# EAGLE design Wave Motion (EAGLE 5.11)

## Sheet 1 of 6
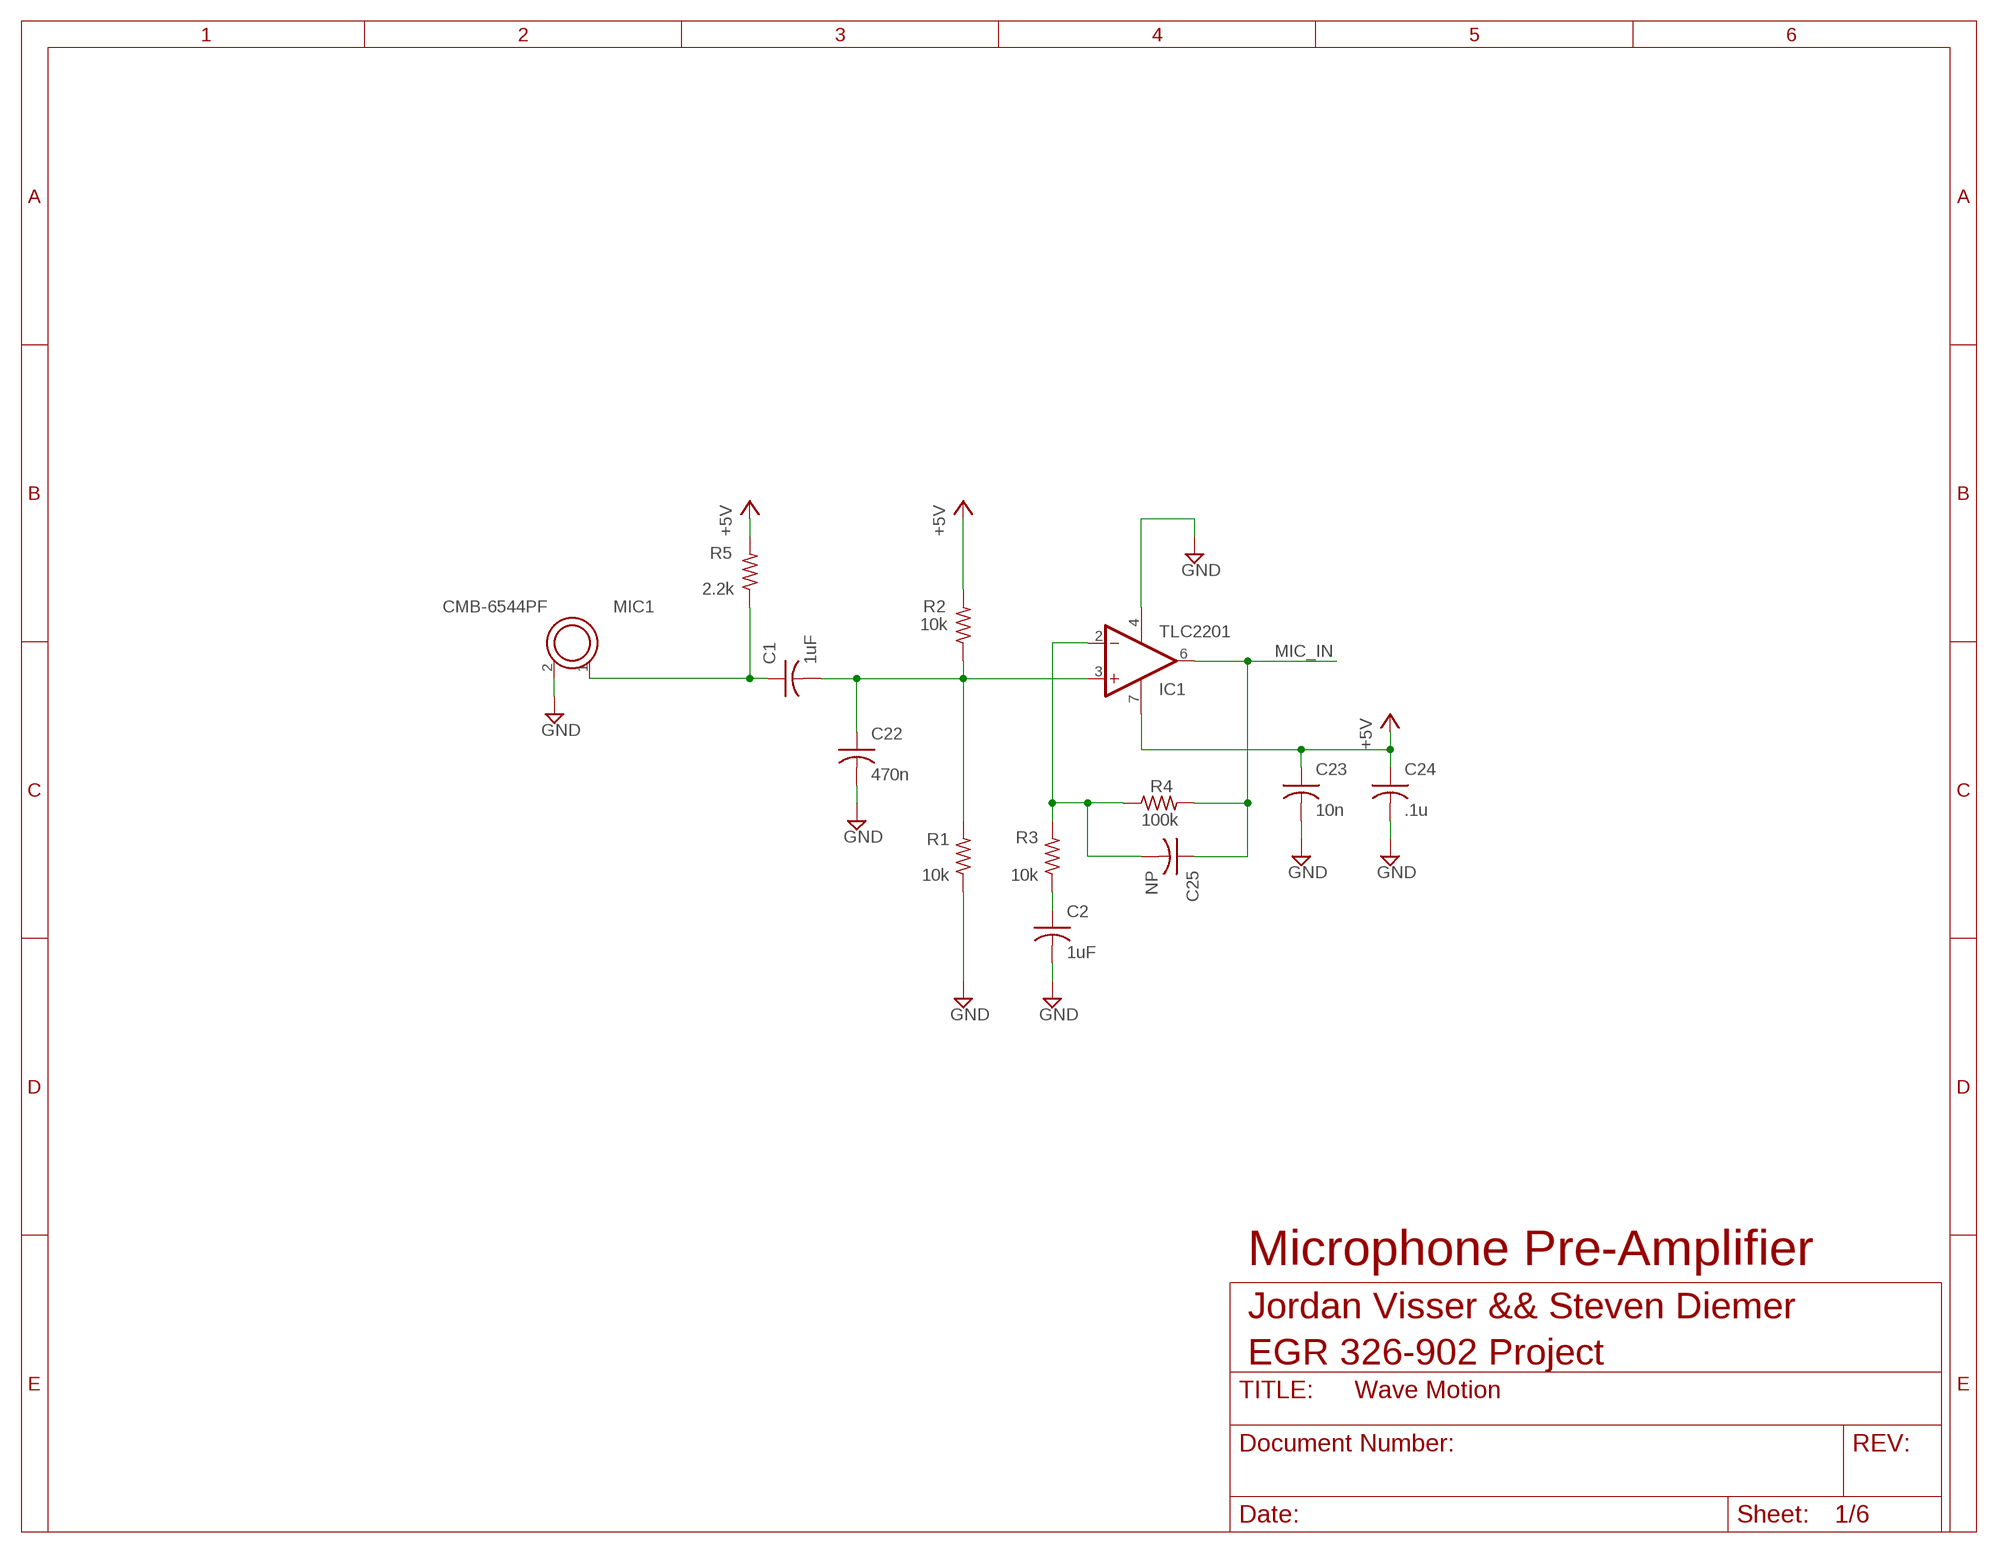
[diagram p0: schematic, sheet 1]

### Parts
C1  1uF  C-USC0805  [C0805]
C2  1uF  C-USC0805  [C0805]
C22  470n  C-USC0805  [C0805]
C23  10n  C-USC0805  [C0805]
C24  .1u  C-USC0805  [C0805]
C25  NP  C-USC0805  [C0805]
IC1  TLC2201  1AMP_P7+4D  [SO08]
MIC1  CMB-6544PF  [CMB-6544PF]
R1  10k  R-US_R0805  [R0805]
R2  10k  R-US_R0805  [R0805]
R3  10k  R-US_R0805  [R0805]
R4  100k  R-US_R0805  [R0805]
R5  2.2k  R-US_R0805  [R0805]

### Nets
+5V: C23.1 C24.1 IC1.7(V+) R2.2 R5.2 ; also sheet 3,5,6
GND: C2.2 C22.2 C23.2 C24.2 IC1.4(V-) MIC1.2 R1.1 ; also sheet 2,3,4,5,6
MIC_IN: C25.1 IC1.6(OUT) R4.2 ; also sheet 3
N$1: C1.2 C22.1 IC1.3(+IN) R1.2 R2.1
N$2: C1.1 MIC1.1 R5.1
N$3: C25.2 IC1.2(-IN) R3.2 R4.1
N$4: C2.1 R3.1

### Notes on the sheet
- Microphone Pre-Amplifier
- Jordan Visser && Steven Diemer
- EGR 326-902 Project

## Sheet 2 of 6
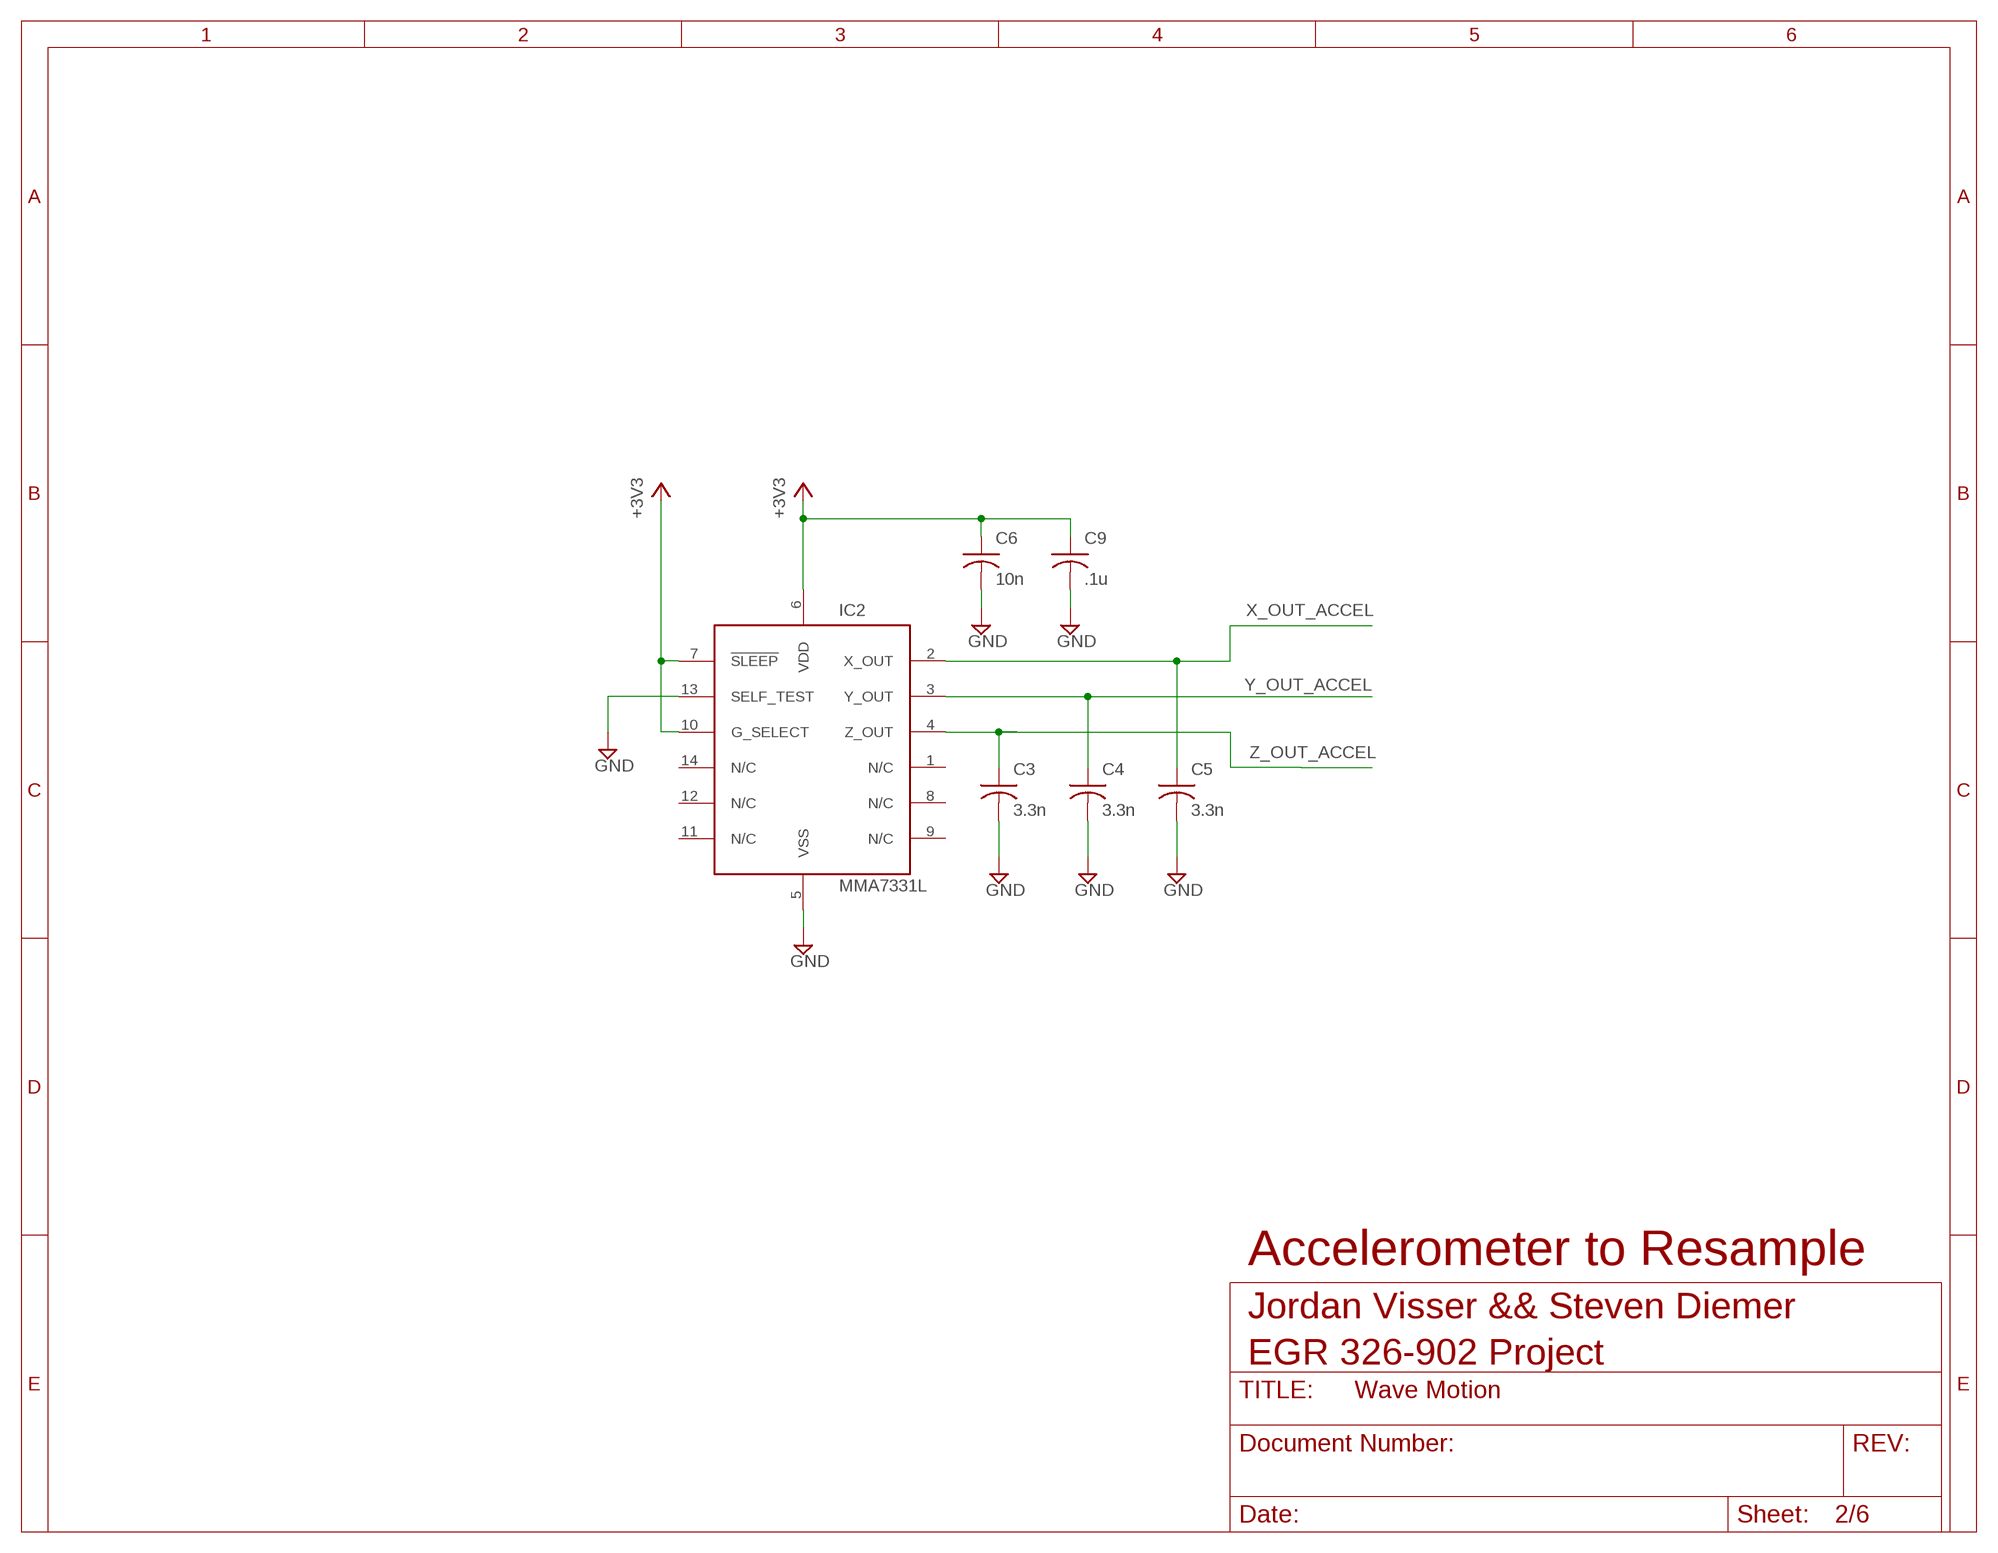
[diagram p1: schematic, sheet 2]

### Parts
C3  3.3n  C-USC0805  [C0805]
C4  3.3n  C-USC0805  [C0805]
C5  3.3n  C-USC0805  [C0805]
C6  10n  C-USC0805  [C0805]
C9  .1u  C-USC0805  [C0805]
IC2  MMA7331L  [LGA14]

### Nets
+3V3: C6.1 C9.1 IC2.6(VDD) IC2.7(!SLEEP) IC2.10(G_SELECT) ; also sheet 3,4
GND: C3.2 C4.2 C5.2 C6.2 C9.2 IC2.5(VSS) IC2.13(SELF_TEST) ; also sheet 1,3,4,5,6
X_OUT_ACCEL: C5.1 IC2.2(X_OUT) ; also sheet 3
Y_OUT_ACCEL: C4.1 IC2.3(Y_OUT) ; also sheet 3
Z_OUT_ACCEL: C3.1 IC2.4(Z_OUT) ; also sheet 3
Unconnected: IC2.1(N/C) IC2.8(N/C) IC2.9(N/C) IC2.11(N/C) IC2.12(N/C) IC2.14(N/C)

### Notes on the sheet
- Accelerometer to Resample
- Jordan Visser && Steven Diemer
- EGR 326-902 Project

## Sheet 3 of 6
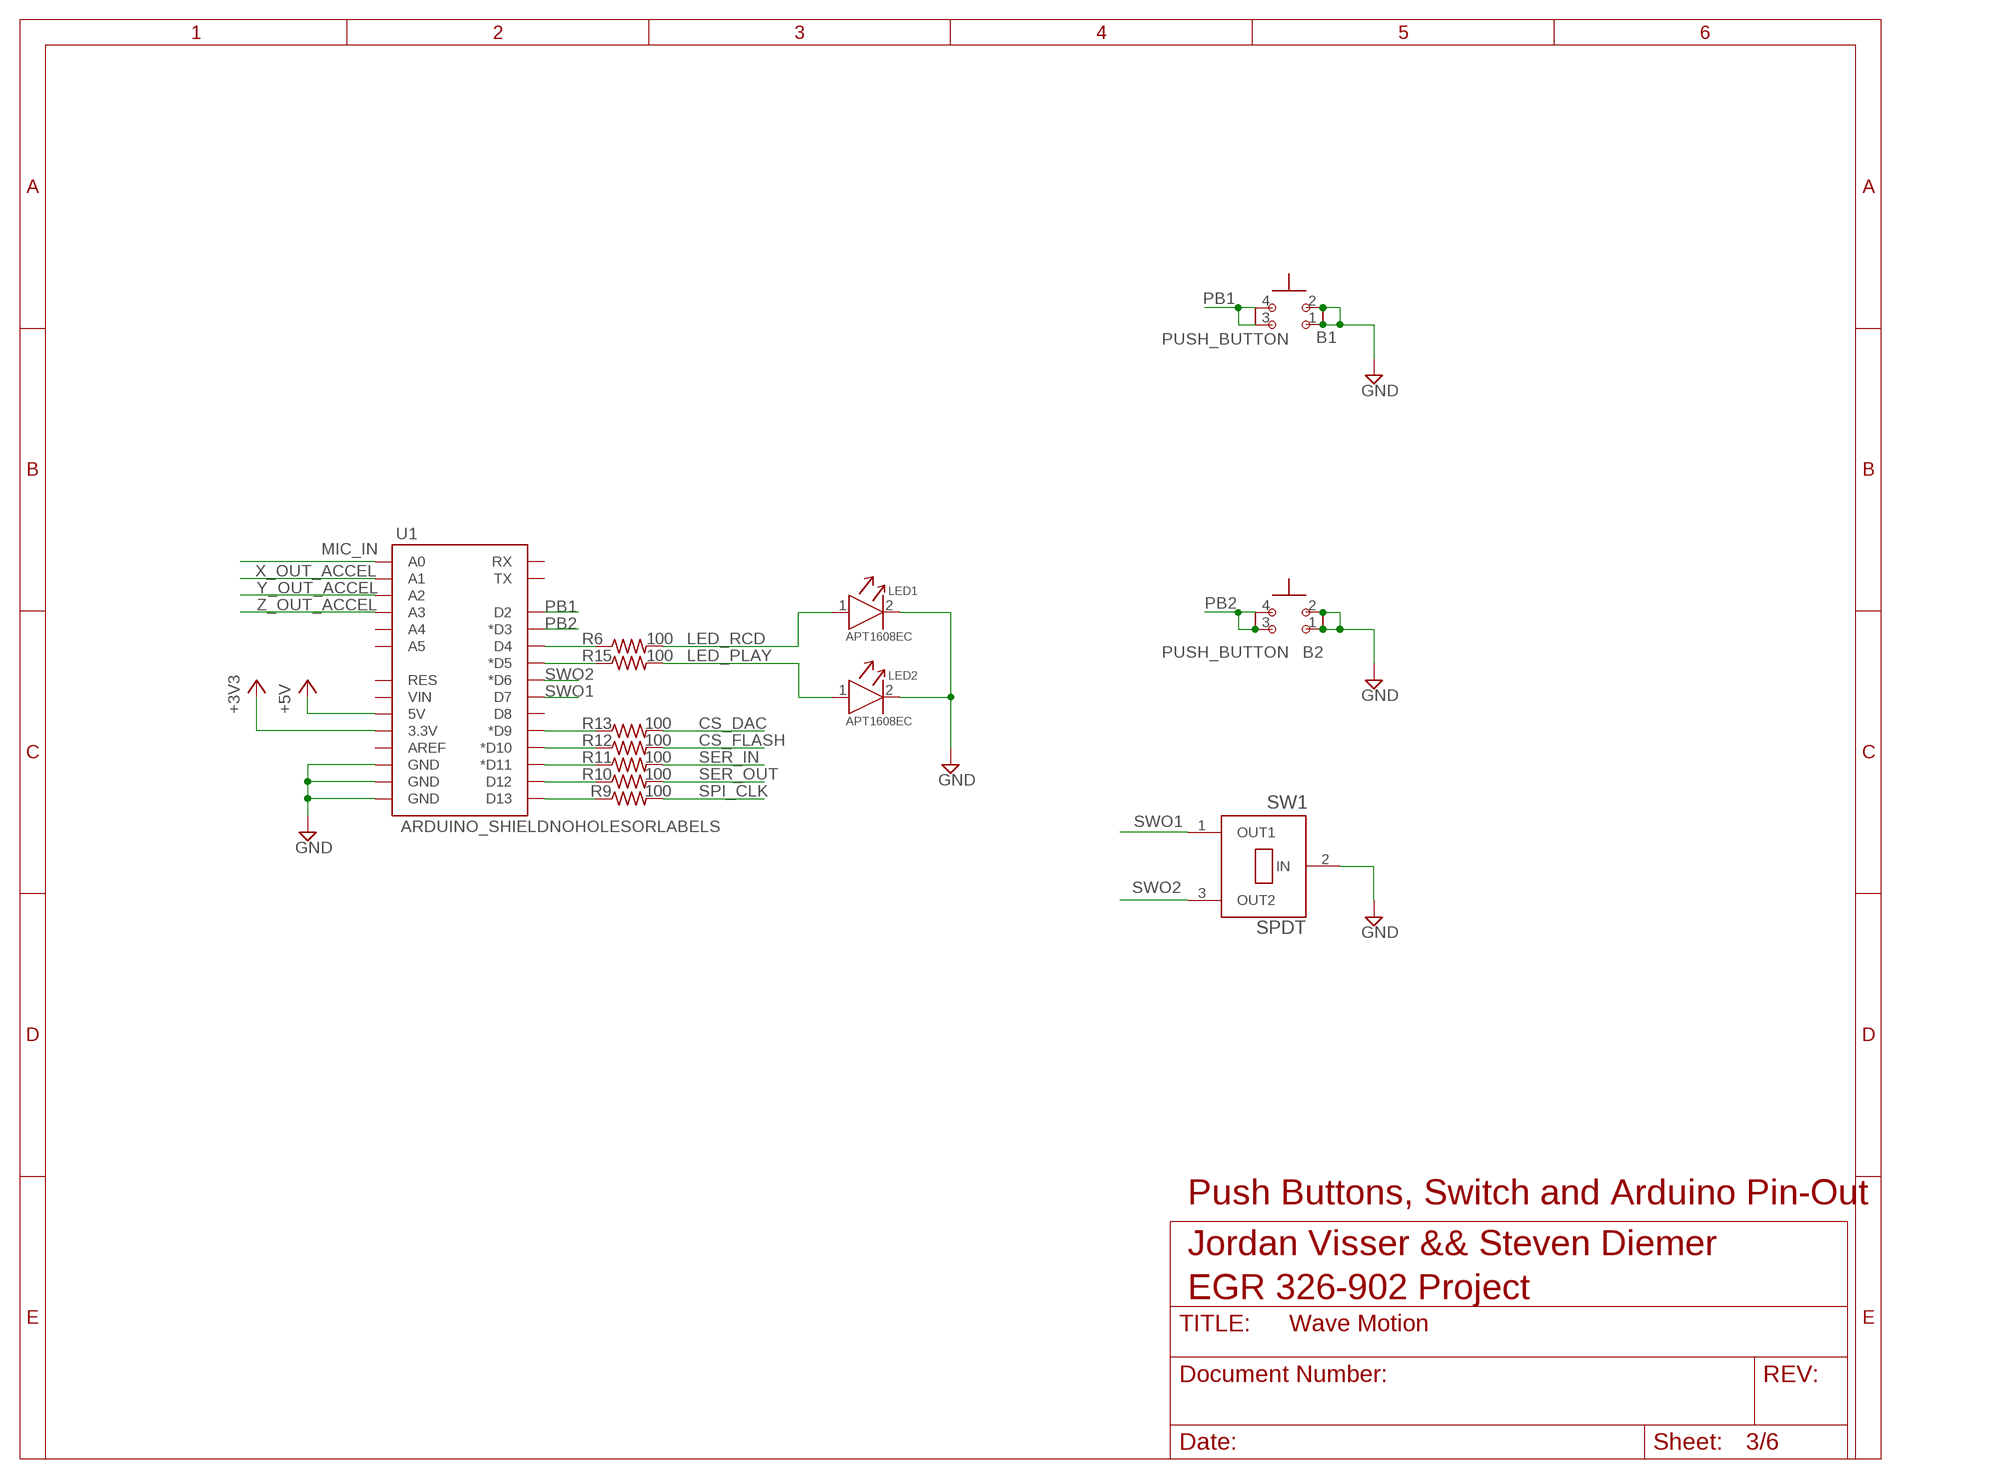
[diagram p2: schematic, sheet 3]

### Parts
B1  PUSH_BUTTON  [PUSH_BUTTON]
B2  PUSH_BUTTON  [PUSH_BUTTON]
LED1  APT1608EC  [0603]
LED2  APT1608EC  [0603]
R6  100  R-US_R0805  [R0805]
R9  100  R-US_R0805  [R0805]
R10  100  R-US_R0805  [R0805]
R11  100  R-US_R0805  [R0805]
R12  100  R-US_R0805  [R0805]
R13  100  R-US_R0805  [R0805]
R15  100  R-US_R0805  [R0805]
SW1  SPDT  [SPDT_3PIN]
U1  ARDUINO_SHIELDNOHOLESORLABELS  [DUEMILANOVE_SHIELD_NOHOLES_NOLABELS]

### Nets
+3V3: U1.3.3V ; also sheet 2,4
+5V: U1.5V ; also sheet 1,5,6
CS_DAC: R13.2 ; also sheet 5
CS_FLASH: R12.2 ; also sheet 4
D9: R13.1 U1.D9(*D9)
D10: R12.1 U1.D10(*D10)
D11: R11.1 U1.D11(*D11)
D12: R10.1 U1.D12
D13: R9.1 U1.D13
GND: B1.1(IN) B1.2(IN) B2.1(IN) B2.2(IN) LED1.2(C) LED2.2(C) SW1.2(IN) U1.GND@0(GND) U1.GND@1(GND) U1.GND@2(GND) ; also sheet 1,2,4,5,6
LED_PLAY: LED2.1(A) R15.2
LED_RCD: LED1.1(A) R6.2
MIC_IN: U1.A0 ; also sheet 1
N$12: R6.1 U1.D4
N$13: R15.1 U1.D5(*D5)
PB1: B1.3(OUT) B1.4(OUT) U1.D2
PB2: B2.3(OUT) B2.4(OUT) U1.D3(*D3)
SER_IN: R11.2 ; also sheet 4,5
SER_OUT: R10.2 ; also sheet 4
SPI_CLK: R9.2 ; also sheet 4,5
SWO1: SW1.1(OUT1) U1.D7
SWO2: SW1.3(OUT2) U1.D6(*D6)
X_OUT_ACCEL: U1.A1 ; also sheet 2
Y_OUT_ACCEL: U1.A2 ; also sheet 2
Z_OUT_ACCEL: U1.A3 ; also sheet 2
Unconnected: U1.A4 U1.A5 U1.AREF U1.D8 U1.RES U1.RX U1.TX U1.VIN

### Notes on the sheet
- Push Buttons, Switch and Arduino Pin-Out
- Jordan Visser && Steven Diemer
- EGR 326-902 Project

## Sheet 4 of 6
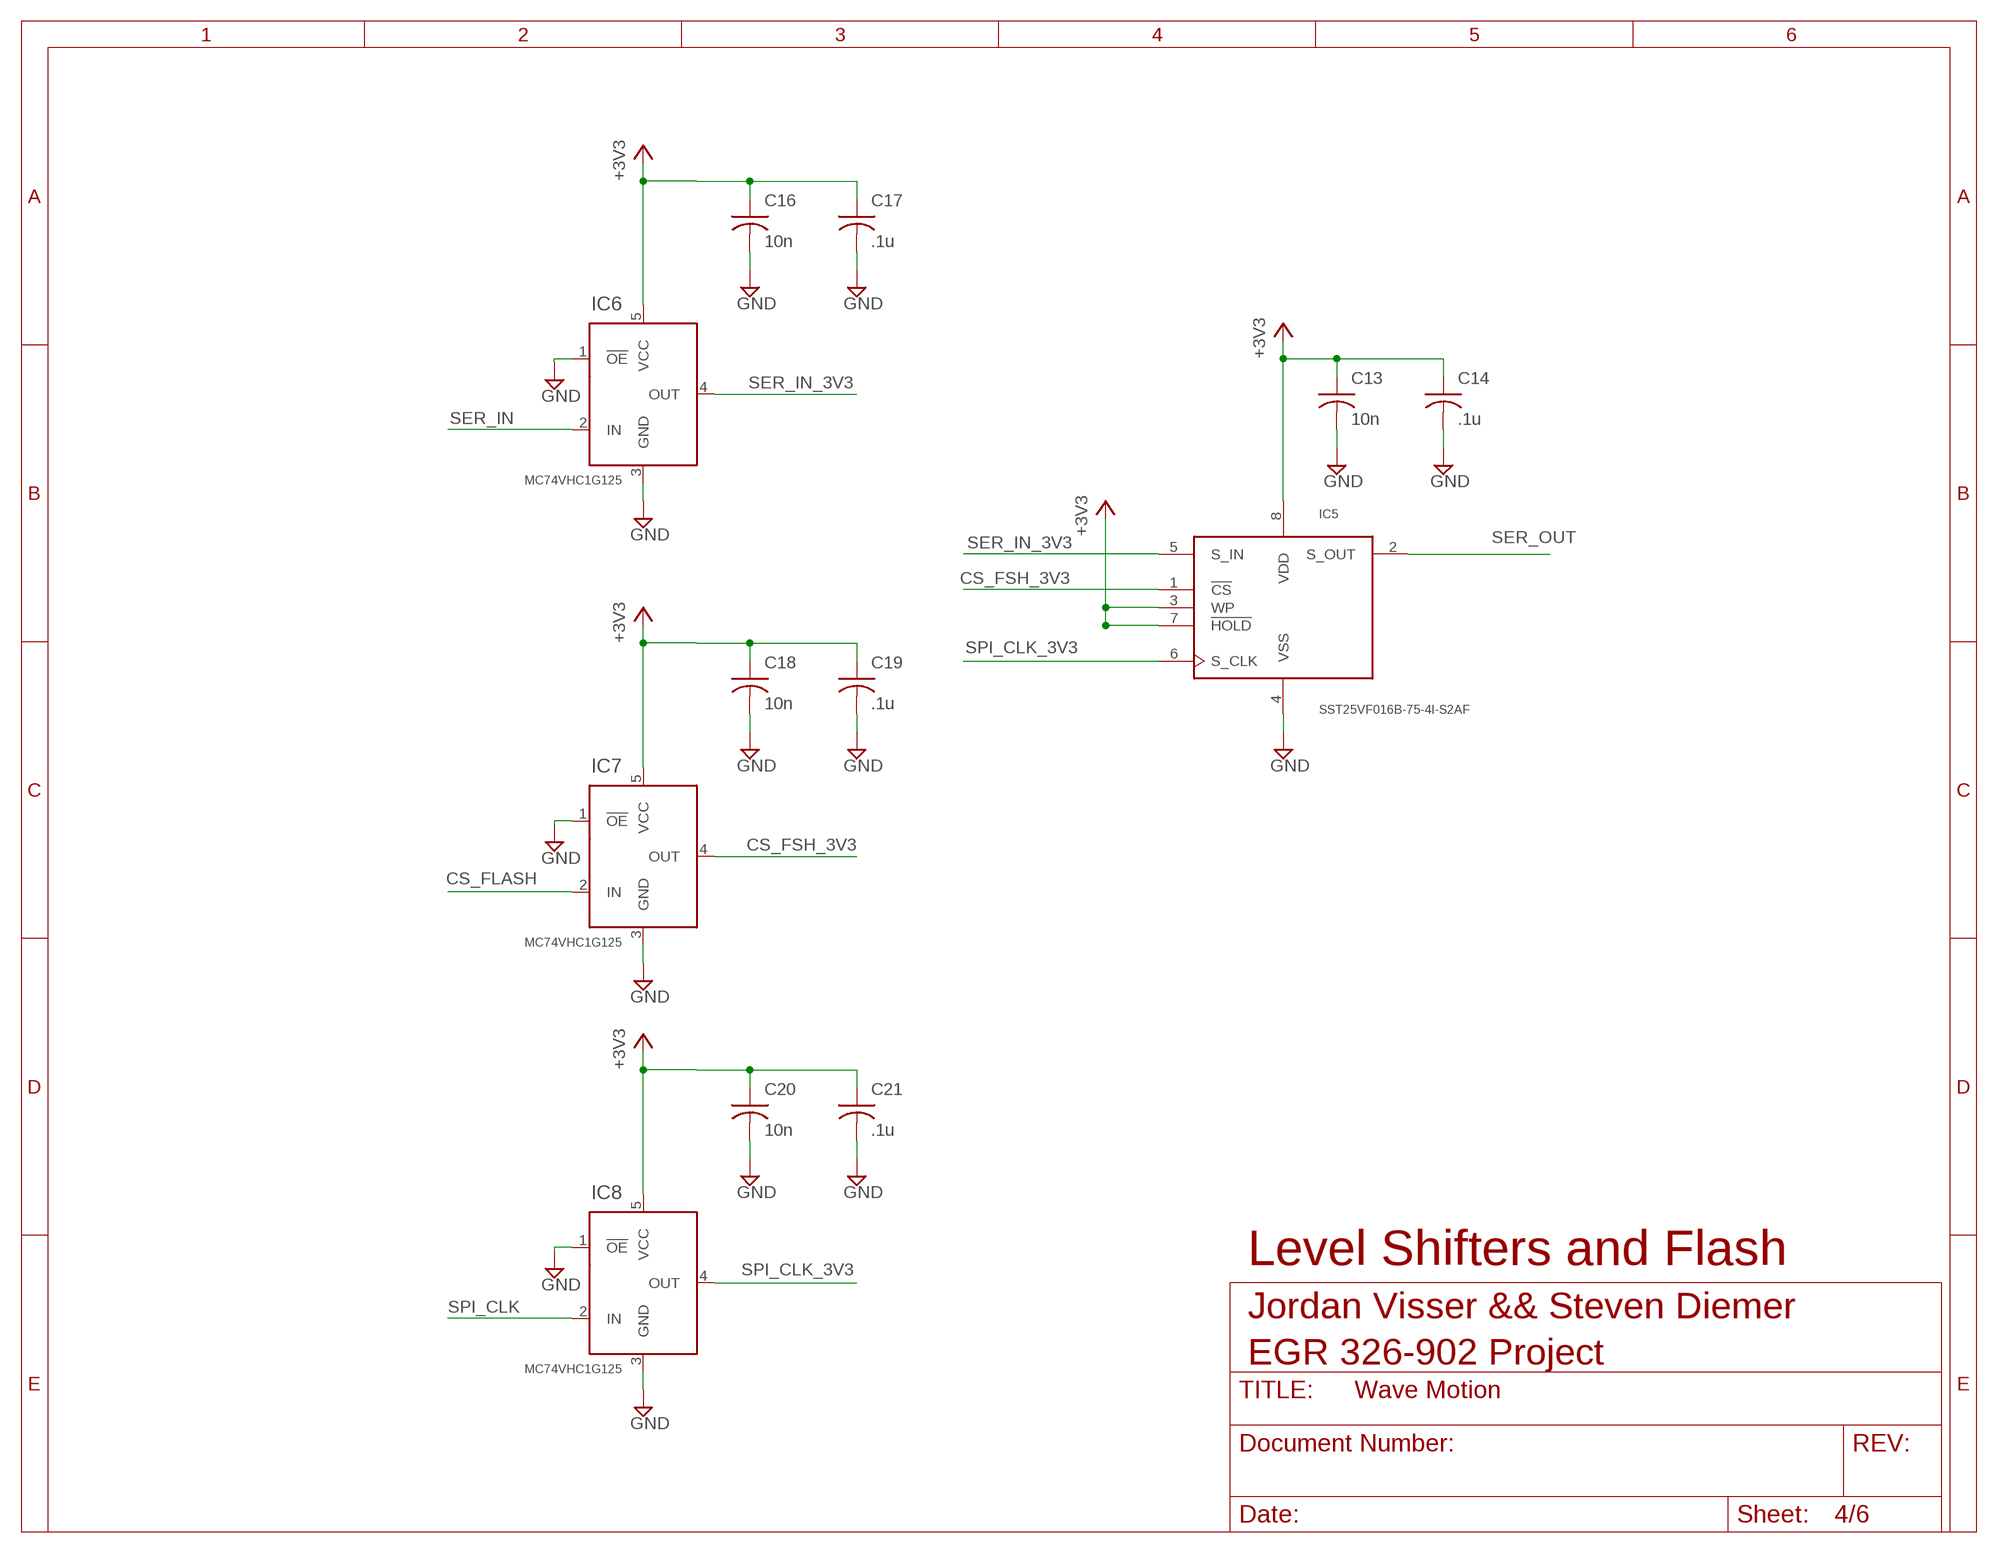
[diagram p3: schematic, sheet 4]

### Parts
C13  10n  C-USC0805  [C0805]
C14  .1u  C-USC0805  [C0805]
C16  10n  C-USC0805  [C0805]
C17  .1u  C-USC0805  [C0805]
C18  10n  C-USC0805  [C0805]
C19  .1u  C-USC0805  [C0805]
C20  10n  C-USC0805  [C0805]
C21  .1u  C-USC0805  [C0805]
IC5  SST25VF016B-75-4I-S2AF  [SST25VF016B-75-4I-S2AF]
IC6  MC74VHC1G125  [MC74VHC1G125]
IC7  MC74VHC1G125  [MC74VHC1G125]
IC8  MC74VHC1G125  [MC74VHC1G125]

### Nets
+3V3: C13.1 C14.1 C16.1 C17.1 C18.1 C19.1 C20.1 C21.1 IC5.3(WP) IC5.7(!HOLD) IC5.8(VDD) IC6.5(VCC) IC7.5(VCC) IC8.5(VCC) ; also sheet 2,3
CS_FLASH: IC7.2(IN) ; also sheet 3
CS_FSH_3V3: IC5.1(!CS) IC7.4(OUT)
GND: C13.2 C14.2 C16.2 C17.2 C18.2 C19.2 C20.2 C21.2 IC5.4(VSS) IC6.1(!OE) IC6.3(GND) IC7.1(!OE) IC7.3(GND) IC8.1(!OE) IC8.3(GND) ; also sheet 1,2,3,5,6
SER_IN: IC6.2(IN) ; also sheet 3,5
SER_IN_3V3: IC5.5(S_IN) IC6.4(OUT)
SER_OUT: IC5.2(S_OUT) ; also sheet 3
SPI_CLK: IC8.2(IN) ; also sheet 3,5
SPI_CLK_3V3: IC5.6(S_CLK) IC8.4(OUT)

### Notes on the sheet
- Level Shifters and Flash
- Jordan Visser && Steven Diemer
- EGR 326-902 Project

## Sheet 5 of 6
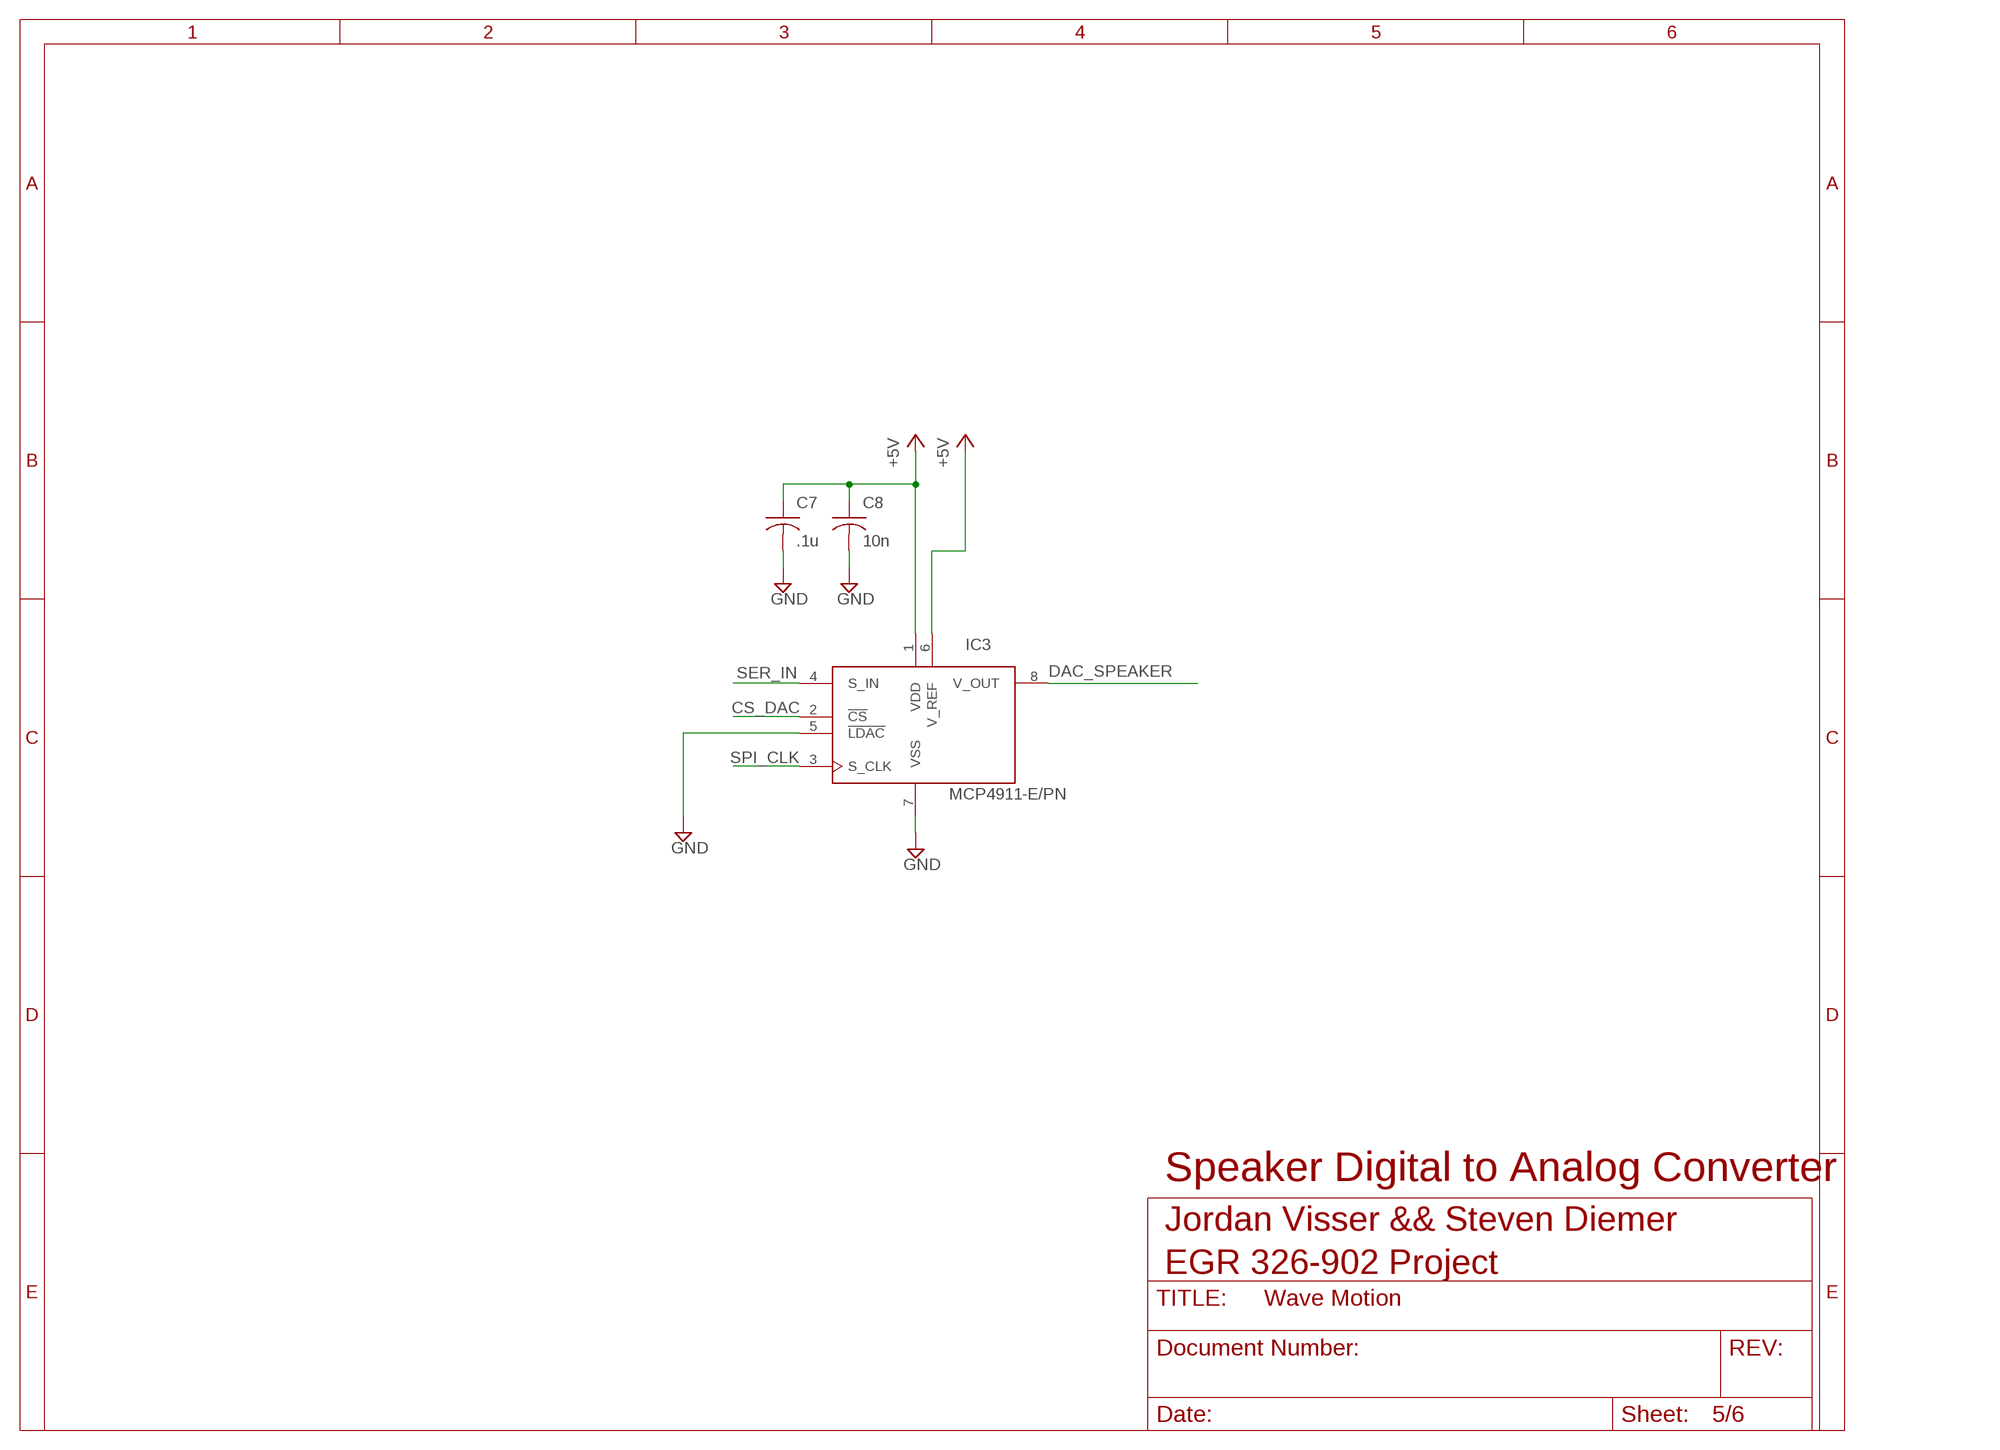
[diagram p4: schematic, sheet 5]

### Parts
C7  .1u  C-USC0805  [C0805]
C8  10n  C-USC0805  [C0805]
IC3  MCP4911-E/PN  [SOIC-8_150MIL-WIDTH]

### Nets
+5V: C7.1 C8.1 IC3.1(VDD) IC3.6(V_REF) ; also sheet 1,3,6
CS_DAC: IC3.2(!CS) ; also sheet 3
DAC_SPEAKER: IC3.8(V_OUT) ; also sheet 6
GND: C7.2 C8.2 IC3.5(!LDAC) IC3.7(VSS) ; also sheet 1,2,3,4,6
SER_IN: IC3.4(S_IN) ; also sheet 3,4
SPI_CLK: IC3.3(S_CLK) ; also sheet 3,4

### Notes on the sheet
- Speaker Digital to Analog Converter
- Jordan Visser && Steven Diemer
- EGR 326-902 Project

## Sheet 6 of 6
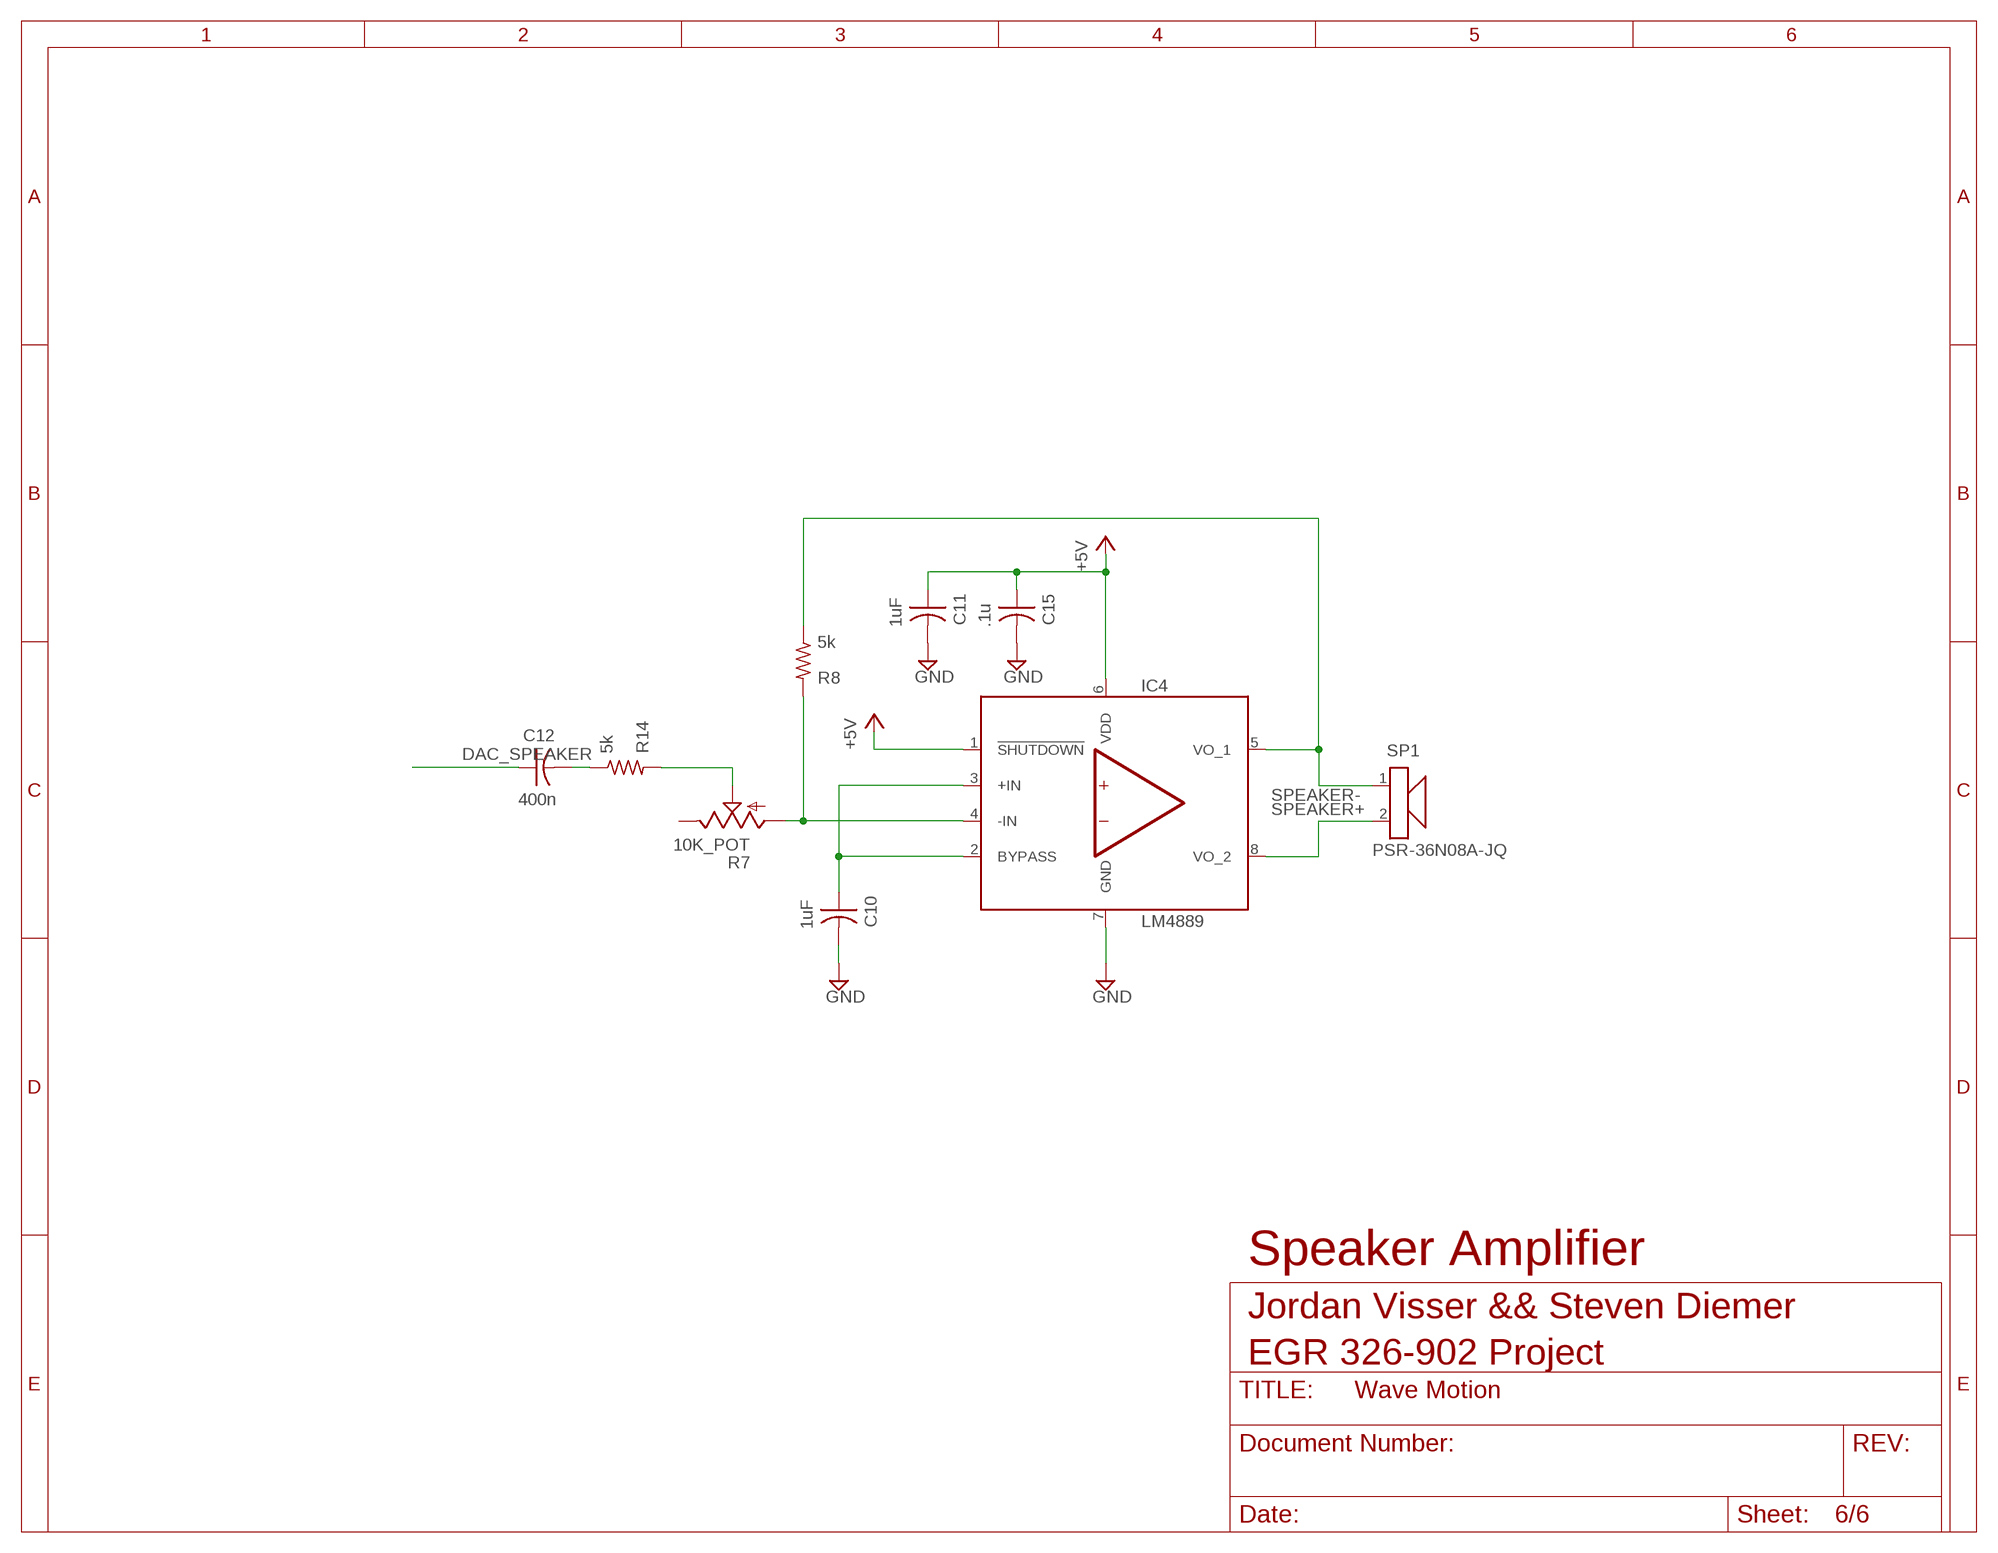
[diagram p5: schematic, sheet 6]

### Parts
C10  1uF  C-USC0805  [C0805]
C11  1uF  C-USC0805  [C0805]
C12  400n  C-USC0805  [C0805]
C15  .1u  C-USC0805  [C0805]
IC4  LM4889  [LM4889_SOIC-8]
R7  10K_POT  [10K_POT]
R8  5k  R-US_R0805  [R0805]
R14  5k  R-US_R0805  [R0805]
SP1  SPEAKER  [SPEAKER_200MIL-SPACE]

### Nets
+5V: C11.1 C15.1 IC4.1(!SHUTDOWN) IC4.6(VDD) ; also sheet 1,3,5
DAC_SPEAKER: C12.1 ; also sheet 5
GND: C10.2 C11.2 C15.2 IC4.7(GND) ; also sheet 1,2,3,4,5
IN-: IC4.4(-IN) R7.1(A) R8.2
N$5: C10.1 IC4.2(BYPASS) IC4.3(+IN)
N$7: R7.2(S) R14.2
N$8: C12.2 R14.1
SPEAKER+: IC4.8(VO_2) SP1.2
SPEAKER-: IC4.5(VO_1) R8.1 SP1.1
Unconnected: R7.3(E)

### Notes on the sheet
- SP1
- PSR-36N08A-JQ
- Speaker Amplifier
- Jordan Visser && Steven Diemer
- EGR 326-902 Project

## Library data of the parts
B1 B2 = ExtraParts:PUSH_BUTTON: Push Button 4 Terminal Push Button
C1-C25 = rcl:C-US: CAPACITOR, American symbol
IC1 = linear:1AMP_P7+4: OP AMP
IC2 = ExtraParts:MMA7331L: MMA7331L - Three Axis Low-g Accelerometer +- 4g or +- 12g Package: 14-Pin LGA http://cache.freescale.com/files/sensors/doc/data_sheet/MMA7331L.pdf
IC3 = Mic:MCP4911-E/P: SPI 10-bit DAC Up to 20 MHz CLK
IC4 = ExtraParts:LM4889: Generic single-channel op-amp
IC5 = Afton:SST25VF016B-75-4I-S2AF: 32 Mbit Flash memory IC. SOIC8 (150mil Width)
IC6-IC8 = ExtraParts:MC74VHC1G125: MC74VHC1G125 SOT23-5 Noninverting 3-State Buffer 5V -> 3V Level Converter
LED1 LED2 = Afton_2:APT1608EC: SMT LED
MIC1 = Mic:CMB-6544PF: CUI Condensor Mic. -44 dB Sensitivity. 20 Hz ~ 20kHz.
R1-R6 R8-R15 = rcl:R-US_: RESISTOR, American symbol
R7 = ExtraParts:10K_POT
SP1 = Mic:SPEAKER
SW1 = ExtraParts:SPDT: SPDT Switch 3 Pin This device is a single-pull double-throw switch connecting either pins 1&2 or pins 2&3
U1 = SparkFun:ARDUINO_SHIELD

## Board
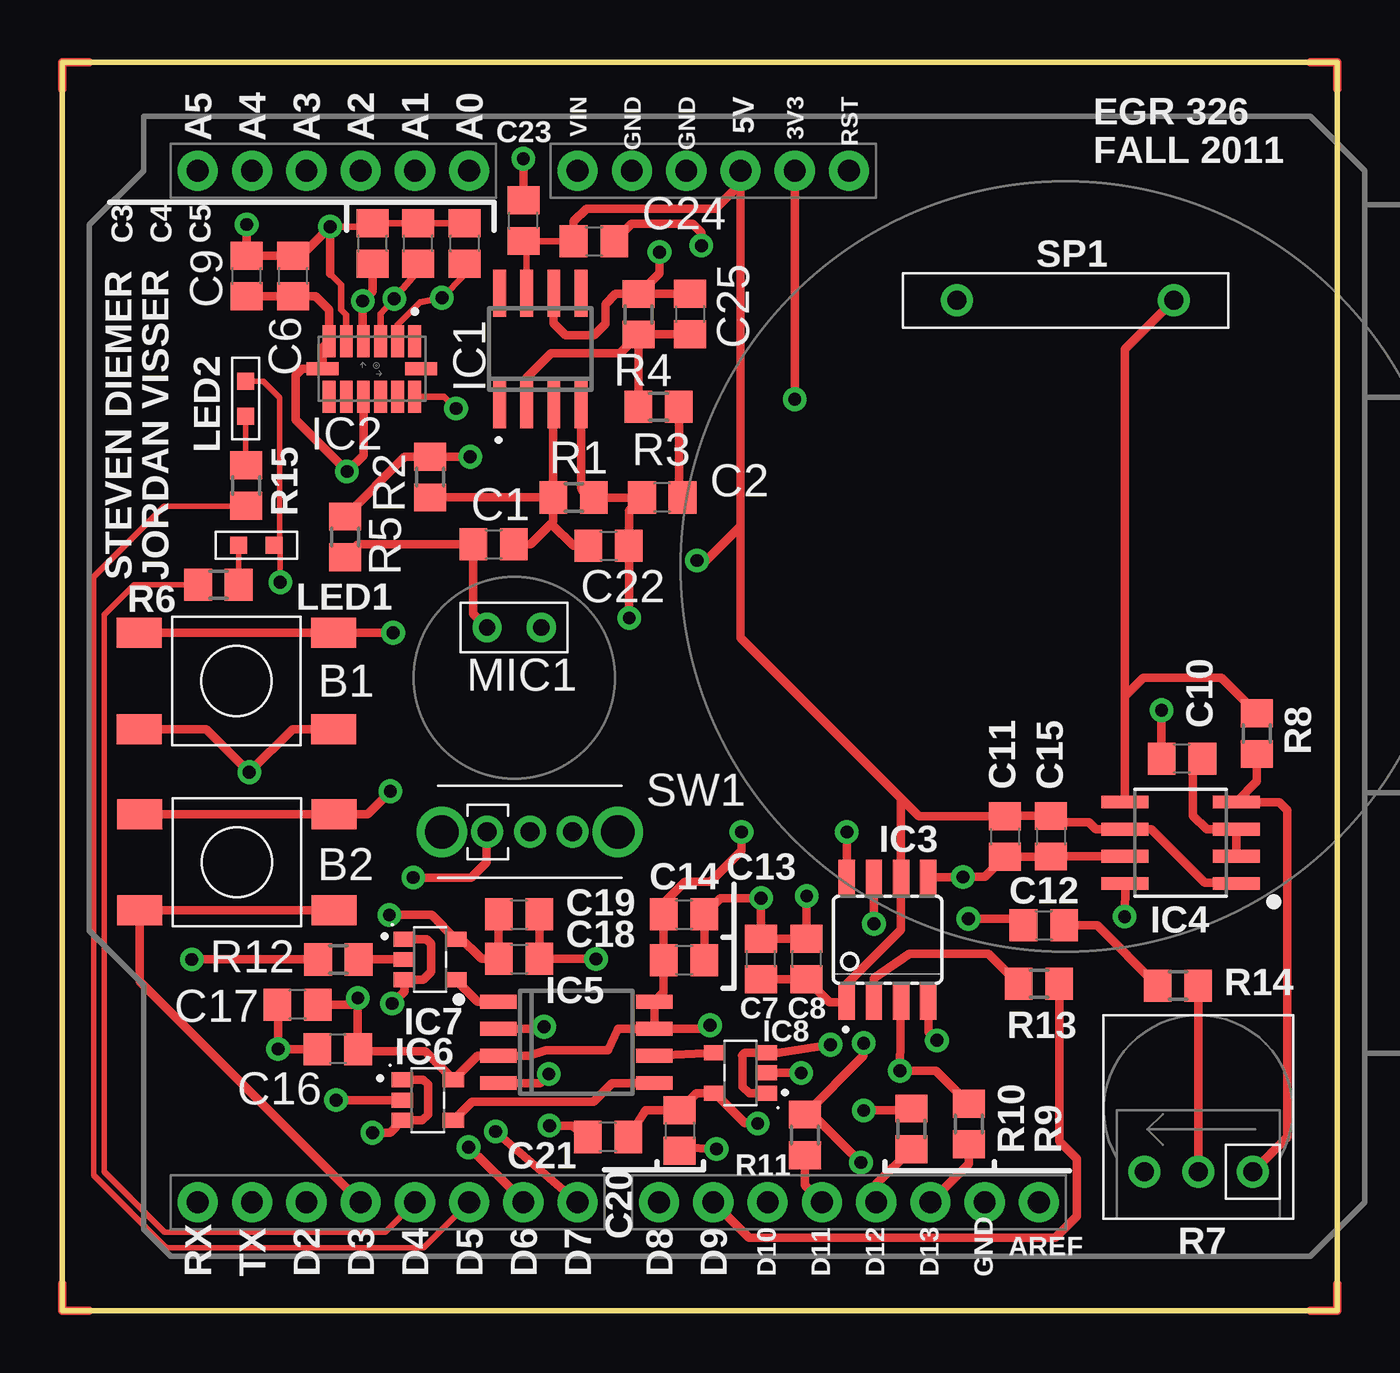
[diagram p6: board, top side]
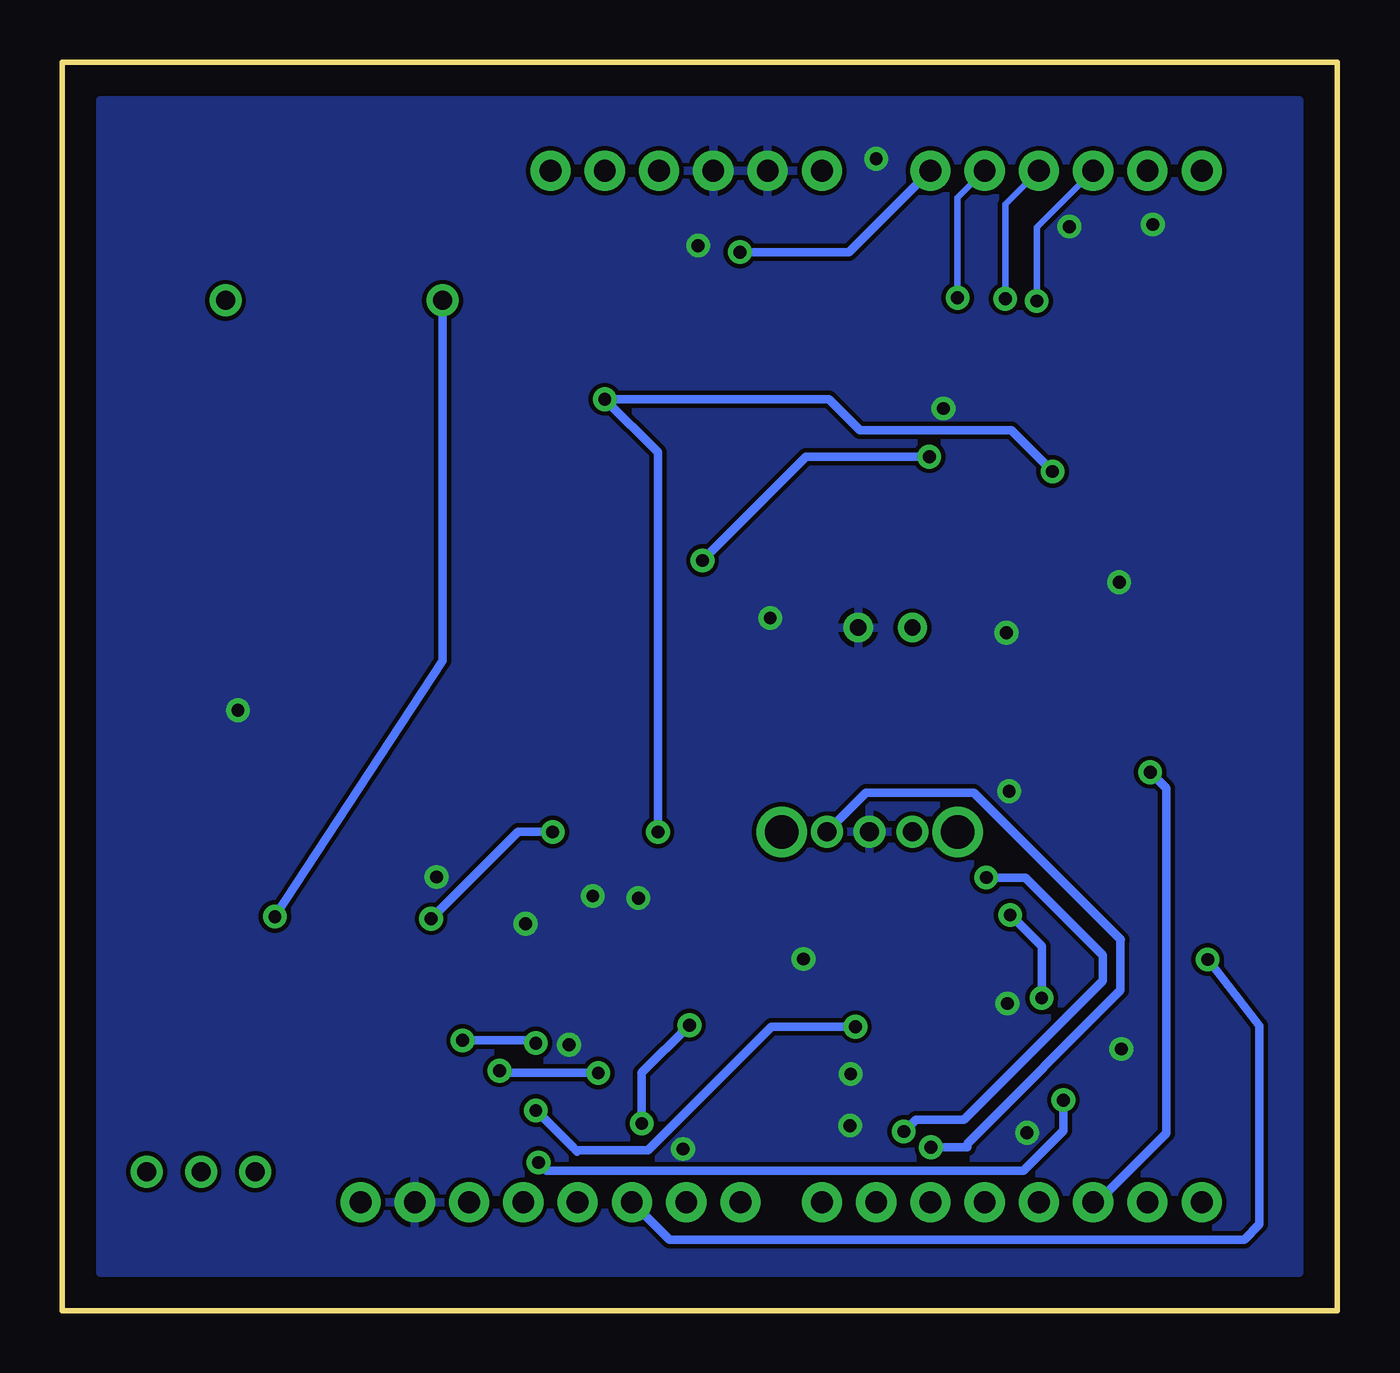
[diagram p7: board, bottom side, seen from below]

Size 59.69 x 58.42 mm. Coordinates in mm from the lower left corner, seen from the top.
Outline: 0,0 0,58.42 59.69,58.42 59.69,0 0,0
Copper layers (1*16): Top 0.035mm / dielectric 1.5mm / Bottom 0.035mm
Design rules "SparkFun *": minimum track width 8mil, minimum drill 20mil, track to track 8mil, track to pad 8mil, pad to pad 8mil, via to via 8mil, smd to smd 8mil, copper to edge 10mil, drill to drill 8mil, minimum pad ring 12mil, minimum via ring 10mil, stop-mask expansion 4mil, vias tented up to drill 25mil, thermal gap 10mil

### Footprints (pad centres in the part's own frame; a part is rotated, then mirrored left to right if it is on the bottom)
PUSH_BUTTON = smd 1.4 x 2.1: 1 2.25,4.55; 2 2.25,-4.55; 3 -2.25,4.55; 4 -2.25,-4.55
C0805 = smd 1.3 x 1.5: 1 -0.95,0; 2 0.95,0
SO08 = smd 0.6 x 2.2: 1 -1.905,-2.6; 2 -0.635,-2.6; 3 0.635,-2.6; 4 1.905,-2.6; 5 1.905,2.6; 6 0.635,2.6; 7 -0.635,2.6; 8 -1.905,2.6
LGA14 = smd 0.6 x 1.5: 1 2,1.3; 2 1.2,1.3; 3 0.4,1.3; 4 -0.4,1.3; 5 -1.2,1.3; 6 -2,1.3; 8 -2,-1.3; 9 -1.2,-1.3; 10 -0.4,-1.3; 11 0.4,-1.3; 12 1.2,-1.3; 13 2,-1.3 | smd 1.5 x 0.6: 7 -2.3,0; 14 2.3,0
SOIC-8_150MIL-WIDTH = smd 0.762 x 1.651: 1 -1.905,-2.921; 2 -0.635,-2.921; 3 0.635,-2.921; 4 1.905,-2.921; 5 1.905,2.921; 6 0.635,2.921; 7 -0.635,2.921; 8 -1.905,2.921
LM4889_SOIC-8 = smd 2.2 x 0.6: 1 -2.6,1.905; 2 -2.6,0.635; 3 -2.6,-0.635; 4 -2.6,-1.905; 5 2.6,-1.905; 6 2.6,-0.635; 7 2.6,0.635; 8 2.6,1.905
SST25VF016B-75-4I-S2AF = smd 1.7 x 0.65: 1 -3.65,1.905; 2 -3.65,0.635; 3 -3.65,-0.635; 4 -3.65,-1.905; 5 3.65,-1.905; 6 3.65,-0.635; 7 3.65,0.635; 8 3.65,1.905
MC74VHC1G125 = smd 0.7 x 1: 1 0.95,1.2; 2 0,1.2; 3 -0.95,1.2; 4 -0.95,-1.2; 5 0.95,-1.2
0603 = smd 0.8 x 0.8: 1 -0.825,0; 2 0.825,0
CMB-6544PF = drill 0.762 round: 1 2.35,1.27; 2 2.35,-1.27
R0805 = smd 1.3 x 1.5: 1 -0.95,0; 2 0.95,0
10K_POT = drill 0.889 round: 1 2.54,-2.87; 2 0,-2.87; 3 -2.54,-2.87
SPEAKER_200MIL-SPACE = drill 0.889 round: 1 -5.08,-12.7; 2 5.08,-12.7
SPDT_3PIN = drill 0.889 round: 1 -2.007,0; 2 0,0; 3 2.007,0 | drill 1.575 pad 2.184 round: NC@1 -4.115,0; NC@2 4.115,0
DUEMILANOVE_SHIELD_NOHOLES_NOLABELS = drill 1.016 pad 1.88 round: 3.3V 50.8,26.67; 5V 50.8,29.21; A0 50.8,41.91; A1 50.8,44.45; A2 50.8,46.99; A3 50.8,49.53; A4 50.8,52.07; A5 50.8,54.61; AREF 2.54,15.24; D2 2.54,49.53; D3 2.54,46.99; D4 2.54,44.45; D5 2.54,41.91; D6 2.54,39.37; D7 2.54,36.83; D8 2.54,33.02; D9 2.54,30.48; D10 2.54,27.94; D11 2.54,25.4; D12 2.54,22.86; D13 2.54,20.32; GND@0 50.8,31.75; GND@1 50.8,34.29; GND@2 2.54,17.78; RES 50.8,24.13; RX 2.54,54.61; TX 2.54,52.07; VIN 50.8,36.83

### Placement (x,y rotation side)
B1  8.15,29.46 90 top
B2  8.18,20.98 90 top
C1  20.19,35.86 0 top
C2  28.09,38.05 180 top
C3  14.53,49.94 90 top
C4  16.66,49.94 90 top
C5  18.85,49.94 90 top
C6  10.82,48.41 90 top
C7  32.72,16.46 90 top
C8  34.85,16.46 90 top
C9  8.64,48.41 90 top
C10  52.41,25.83 180 top
C11  44.13,22.19 270 top
C12  45.95,18.03 0 top
C13  29.11,16.41 0 top
C14  29.11,18.54 0 top
C15  46.28,22.2 270 top
C16  12.9,12.24 180 top
C17  11.02,14.33 180 top
C18  21.39,16.46 0 top
C19  21.39,18.54 0 top
C20  28.91,8.43 270 top
C21  25.55,8.13 180 top
C22  25.58,35.79 0 top
C23  21.59,51 90 top
C24  24.89,50.04 0 top
C25  29.39,46.63 270 top
IC1  22.38,45 0 top
IC2  14.5,44.07 0 top
IC3  38.63,17.36 0 top
IC4  52.35,21.89 180 top
IC5  24.07,12.56 0 top
IC6  17.12,9.86 90 top
IC7  17.22,16.43 90 top
IC8  31.75,11.13 270 top
LED1  9.09,35.81 0 top
LED2  8.59,42.67 90 top
MIC1  21.16,29.62 90 top
R1  23.94,38.05 180 top
R2  17.22,39 90 top
R3  27.91,42.29 180 top
R4  26.99,46.62 90 top
R5  13.25,36.21 90 top
R6  7.32,33.96 0 top
R7  53.19,9.37 0 top
R8  55.92,27 270 top
R9  42.44,8.74 90 top
R10  39.75,8.51 90 top
R11  34.77,8.23 90 top
R12  12.93,16.43 0 top
R13  45.72,15.29 180 top
R14  52.22,15.21 0 top
R15  8.61,38.61 90 top
SP1  46.96,34.57 180 top
SW1  21.89,22.4 0 top
U1  60.96,2.54 90 top

### Tracks (layer width: path | path; a pad name or v marks a point on that pad's centre or on a via)
+3V3  (via drill 0.6)
  Top 0.406: v31.8,22.4 31.8,21.51 30.35,20.07 29.16,20.07 28.16,19.07 C14.1 C13.1 | 32.54,8.74 v32.56,8.76 31.96,8.76 IC8.5 29.7,10.18 C20.1 27.3,9.38 C21.1 | v13.84,14.63 13.86,14.62 | v15.32,18.52 17.29,18.52 IC7.5 18.56,17.53 19.63,16.46 C18.1 C19.1 | C13.1 28.09,16.34 | v13.84,14.63 13.54,14.33 C17.1 | v13.84,14.63 13.84,12.25 C16.1 13.96,12.14 16.98,12.14 IC6.5 19.44,11.93 IC5.3 21.86,11.93 22.66,12.19 25.55,12.19 26.02,13.2 IC5.7 | v30.33,13.36 30.16,13.2 IC5.7 | IC5.7 IC5.8 28.16,14.91 C13.1 | C9.1 C6.1 11.87,47.46 12.5,46.84 12.5,45.63 IC2.6 12.2,45.07 IC2.7 11.23,44.07 10.92,43.76 10.92,42.32 10.92,41.68 v13.34,39.27 14.1,40.04 IC2.10 | v34.29,42.65 U1.3.3V
  Bottom 0.406: v32.56,8.76 32.56,11.12 30.35,13.34 v30.33,13.36 | v13.84,14.63 13.84,17.04 v15.32,18.52 | v31.8,22.4 31.8,40.16 v34.29,42.65 23.8,42.65 22.35,41.2 15.27,41.2 v13.34,39.27
+5V  (via drill 0.6)
  Top 0.305: IC1.7 21.74,49.9 C23.1 21.61,50.04 C24.1
  Top 0.406: v19.1,39.95 R2.2 16.04,39.95 R5.2 | IC3.1 36.69,14.4 | IC3.1 36.73,15.29 38.18,16.74 39.27,17.83 IC3.6 39.27,23.98 | C24.1 23.94,50.97 24.54,51.56 30.58,51.56 31.75,52.73 U1.5V | IC3.1 35.92,14.44 C8.1 C7.1 | 39.27,23.98 40.11,23.14 C11.1 44.15,23.15 C15.1 46.57,22.86 48.06,22.86 48.39,22.53 IC4.6 50.98,22.53 53.49,20.02 54.92,20.02 IC4.1 | U1.5V 31.77,53.31 | 39.27,23.98 31.75,31.5 31.75,36.7 | 31.75,36.7 U1.5V | v29.72,35.1 30.15,35.1 31.75,36.7
  Bottom 0.406: v19.1,39.95 24.87,39.95 v29.72,35.1
CS_DAC
  Top 0.406: R13.2 43.35,16.71 39.65,16.71 38,15.54 IC3.2
CS_FLASH
  Top 0.406: R12.2 IC7.2
CS_FSH_3V3
  Top 0.406: IC7.4 19.44,14.46 IC5.1
D9
  Top 0.406: R13.1 46.67,7.94 47.5,7.11 47.5,4.42 46.48,3.4 34.49,3.4 32.16,3.4 U1.D9
D10  (via drill 0.6)
  Top 0.406: v6.07,16.43 R12.1
  Bottom 0.406: U1.D10 31.27,3.33 5.26,3.33 4.37,3.33 3.66,4.04 3.66,13.34 v6.07,16.43
D11
  Top 0.406: U1.D11 34.77,5.87 R11.1
D12
  Top 0.406: R10.1 38.1,5.91 U1.D12
D13
  Top 0.406: U1.D13 42.44,6.88 R9.1
DAC_SPEAKER  (via drill 0.6)
  Top 0.406: C12.1 44.69,18.34 v42.42,18.34 | IC3.8 v36.73,22.4
  Bottom 0.406: v42.42,18.34 38.35,22.4 v36.73,22.4
GND  (via drill 0.6)
  Top 0.254: v10.21,34.09 10.21,35.52 LED1.2 10.19,36.08 10.19,42.72 9.41,43.5 LED2.2
  Top 0.305: 12.55,48.51 13.06,48.01 13.06,46.84 13.3,46.59 IC2.5 | v12.55,50.72 14.37,50.72 C3.2 C4.2 C5.2 | IC2.13 17.89,42.77 v18.44,42.22
  Top 0.406: IC3.7 v38,18.11 | v12.55,50.72 12.55,50.48 | IC3.5 v42.16,20.28 v42.16,20.3 43.19,20.3 C11.2 46.27,21.24 C15.2 IC4.7 | IC1.4 24.28,38.66 arc90 R1.1 C2.2 26.53,37.44 C22.2 26.53,34 v26.54,32.41 | IC7.1 17.07,17.37 17.27,17.17 17.27,15.85 16.91,15.48 IC7.3 16.02,14.95 v15.44,14.38 | IC6.1 16.91,10.8 17.12,10.59 17.12,9.17 16.86,8.9 IC6.3 15.35,8.33 v14.53,8.33 | IC8.1 32.17,10.18 31.85,10.49 31.85,11.91 31.83,11.94 31.96,12.07 IC8.3 33.56,12.07 v35.97,12.45 | B1.1 B1.2 v15.48,31.71 v15.49,31.73 | v15.37,24.31 14.29,23.23 B2.2 B2.1 | C23.2 v21.59,53.9 | C24.2 26.66,50.85 29.52,50.85 29.92,50.44 v29.92,49.84 | v12.55,50.72 11.19,49.36 | 12.55,48.51 v12.55,50.72 | C13.2 C14.2 30.82,19.3 v32.72,19.3 C7.2 C8.2 v34.85,19.41 | C10.2 v51.46,28.09 | C17.2 10.11,14.33 v10.11,12.24 C16.2 | C19.2 C18.2 v24.99,16.46 | C20.2 29.04,7.62 v30.63,7.57 | C21.2 23.84,8.66 v22.81,8.66 | IC5.4 22.36,10.65 v22.78,11.07 | C6.2 C9.2 v8.64,50.83
  pour Bottom: 1.78,1.78 1.78,56.64 57.91,56.64 57.91,1.78
IN-
  Top 0.406: R8.2 55.92,24.77 IC4.4 56.97,23.8 57.35,23.42 57.35,8.13 R7.1
LED_PLAY
  Top 0.254: R15.2 8.59,39.58 LED2.1
LED_RCD
  Top 0.254: R6.2 LED1.1
MIC_IN  (via drill 0.6)
  Top 0.406: IC1.6 23.01,46.2 23.57,45.64 24.89,45.64 25.43,46.18 25.43,47.09 25.91,47.57 R4.2 | R4.2 27.96,48.55 v27.96,49.53 | C25.1 26.99,47.58 R4.2
  Bottom 0.406: U1.A0 22.86,49.53 v27.96,49.53
N$1
  Top 0.406: R2.1 R1.2 | R1.2 22.99,42.37 IC1.3 | C1.2 21.92,35.87 22.89,36.83 | 22.89,36.83 22.99,36.93 R1.2 | C22.1 23.93,35.79 22.89,36.83
N$2
  Top 0.406: R5.1 13.85,35.87 C1.1 19.24,32.61 MIC1.1
N$3
  Top 0.406: R4.1 26.99,42.31 R3.2 | IC1.2 21.74,43.66 22.89,44.81 26.12,44.81 R4.1 | C25.2 26.99,45.68 R4.1
N$4
  Top 0.406: R3.1 28.86,38.23 C2.1
N$5
  Top 0.406: IC4.2 IC4.3 53.57,22.53 52.93,23.16 52.93,25.4 C10.1
N$6
  Top 0.406: 0,1.27 0,0 1.27,0
N$7
  Top 0.406: R7.2 53.17,6.52 R14.2
N$8
  Top 0.406: R14.1 48.45,18.03 C12.2
N$9
  Top 0.406: 0,57.15 0,58.42 1.27,58.42
N$10
  Top 0.406: 58.42,58.42 59.69,58.42 59.69,57.15
N$11
  Top 0.406: 59.69,1.27 59.69,0 58.42,0
N$12
  Top 0.254: U1.D4 15.11,3.68 12.85,3.68 4.8,3.68 1.98,6.5 1.98,21.11 1.98,32.56 3.38,33.96 R6.1
N$13
  Top 0.254: U1.D5 16.92,2.95 4.88,2.95 1.47,6.35 1.47,34.34 4.78,37.64 8.61,37.64 R15.1
PB1  (via drill 0.6)
  Top 0.406: B1.4 10.78,27.21 v8.76,25.2 6.75,27.21 B1.3
  Bottom 0.406: U1.D2 11.23,5.08 8,8.31 8,24.43 v8.76,25.2
PB2
  Top 0.406: B2.4 B2.3 3.63,15.42 U1.D3
SER_IN  (via drill 0.6)
  Top 0.406: v37.52,12.52 37.52,11.92 R11.2 35.14,9.18 v37.39,6.93 | v40.95,12.65 40.54,13.06 IC3.4 | v12.83,9.86 IC6.2
  Bottom 0.406: v37.52,12.52 37.64,12.65 v40.95,12.65 | v37.39,6.93 37.01,6.55 36.09,6.55 24.21,6.55 14.71,6.55 12.83,8.43 v12.83,9.86
SER_IN_3V3
  Top 0.406: IC6.4 19.19,9.78 24.87,9.78 25.74,10.65 IC5.5
SER_OUT  (via drill 0.6)
  Top 0.406: R10.2 39.66,9.37 v37.52,9.37 | v22.55,13.28 22.47,13.2 IC5.2
  Bottom 0.406: 35.76,7.62 35.59,7.44 | 35.76,7.62 v37.52,9.37 | 35.76,7.62 35.66,7.52 32.26,7.52 30.07,9.7 26.49,13.28 v22.55,13.28
SPEAKER+  (via drill 0.6)
  Top 0.406: IC4.8 49.77,19.96 v49.73,18.44
  Bottom 0.406: v49.73,18.44 41.88,30.4 SP1.2
SPEAKER-
  Top 0.406: IC4.5 49.75,28.75 | 49.75,28.75 49.75,44.97 SP1.1 | R8.1 54.25,29.62 51,29.62 50.61,29.62 49.75,28.75
SPI_CLK  (via drill 0.6)
  Top 0.406: IC3.3 v39.22,11.23 40.9,11.23 R9.2 | IC8.2 v34.59,11.12
  Bottom 0.406: v34.59,11.12 38.68,11.12 v39.22,11.23
SPI_CLK_3V3
  Top 0.406: IC8.4 IC5.6
SWO1  (via drill 0.6)
  Top 0.406: v20.3,8.38 U1.D7 | v16.43,20.27 19.15,20.27 19.86,20.98 19.86,22.37 SW1.1
  Bottom 0.406: 20.27,8.38 v20.3,8.38 19.74,8.94 17.48,8.94 10.97,15.44 10.97,16.64 14.61,20.27 v16.43,20.27
SWO2  (via drill 0.6)
  Top 0.406: U1.D6 21.59,5.16 v19.02,7.64
  Bottom 0.406: v19.02,7.64 17.32,7.64 17.32,7.82 10.16,14.99 10.16,17.32 10.13,17.35 17.02,24.23 22.07,24.23 SW1.3
X_OUT_ACCEL  (via drill 0.6)
  Top 0.305: IC2.2 15.7,46.13 16.76,47.19 v17.78,47.4 18.85,48.46 C5.1
  Bottom 0.305: U1.A1 17.78,52.07 v17.78,47.4
Y_OUT_ACCEL  (via drill 0.6)
  Top 0.305: C4.1 16.66,48.67 v15.54,47.35 14.9,46.65 IC2.3
  Bottom 0.305: U1.A2 15.54,51.77 v15.54,47.35
Z_OUT_ACCEL  (via drill 0.6)
  Top 0.406: IC2.4 14.07,45.66 v14.07,47.24 14.53,47.7 C3.1
  Bottom 0.305: U1.A3 14.07,50.7 v14.07,47.24

### Text on the board
tPlace: VIN | GND | GND | 5V | 3V3 | RST | A5 | A4 | A3 | A2 | A1 | A0 | EGR 326 | FALL 2011 | STEVEN DIEMER | JORDAN VISSER | AREF | RX | TX | D2 | D3 | D4 | D5 | D6 | D7 | D8 | D9 | D10 | D11 | D12 | D13 | GND